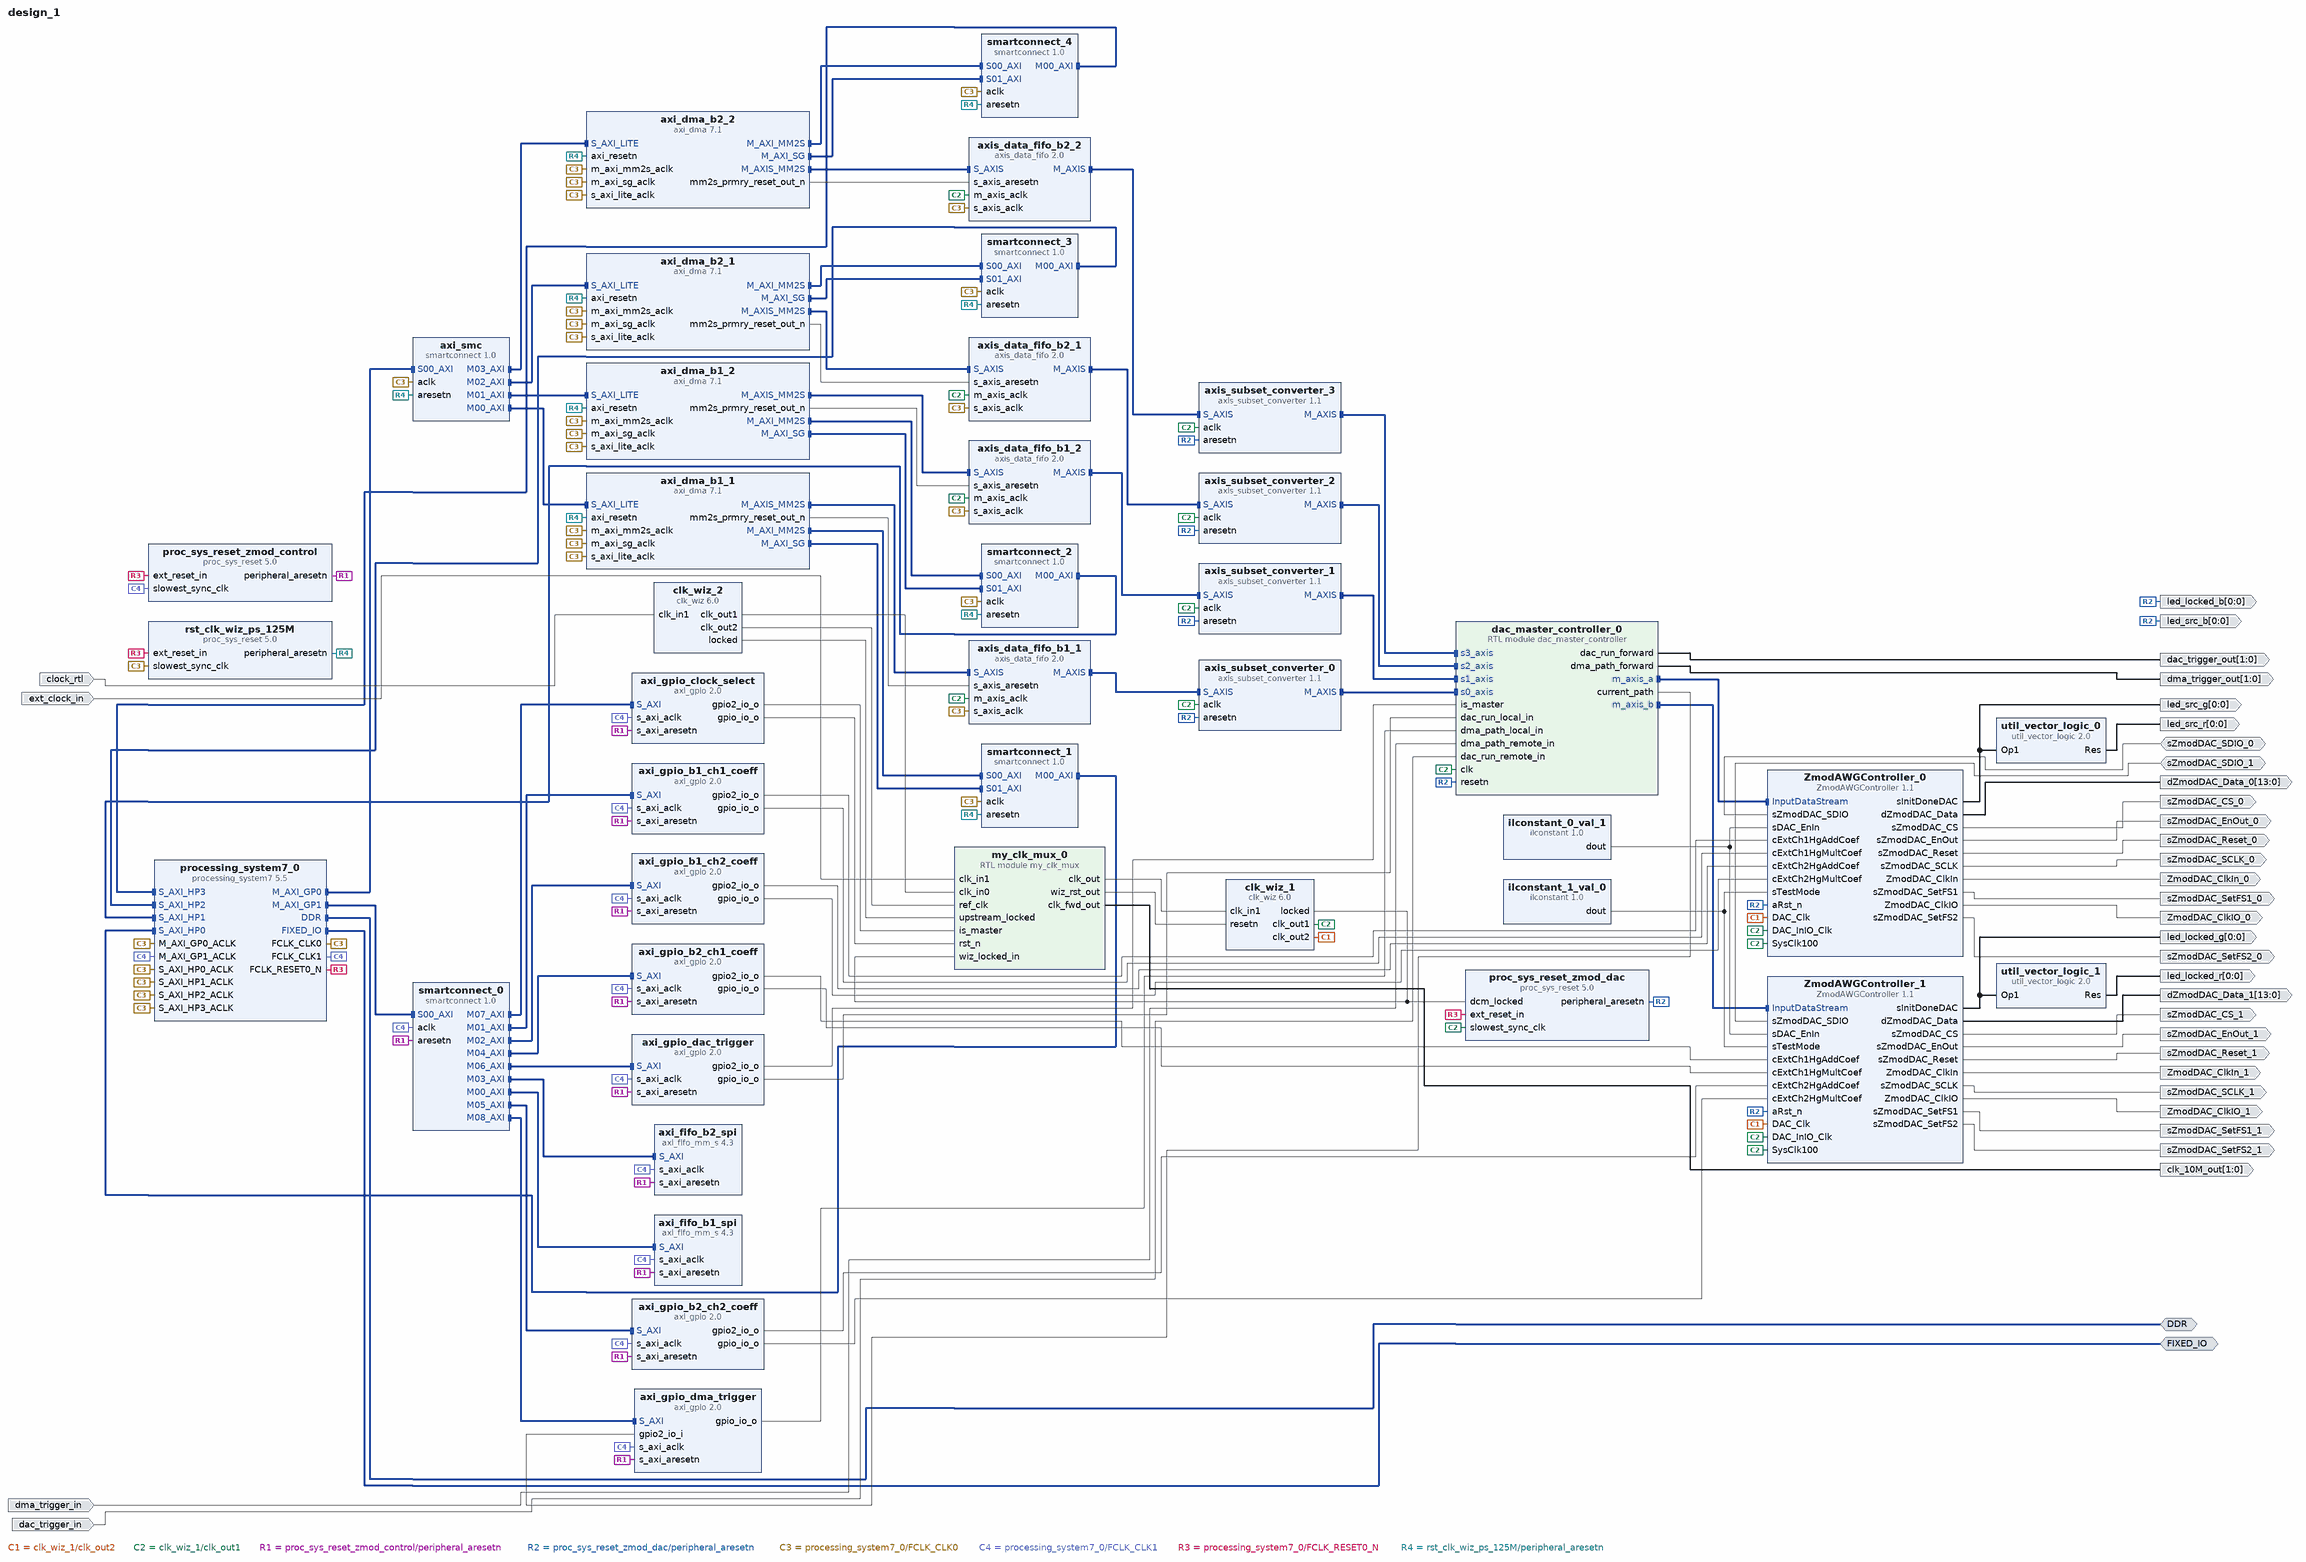
[diagram p0: block diagram of the top level]
# Vivado block design design_1, xc7z020clg484-1, Vivado 2025.1
create_bd_design design_1

create_bd_intf_port -mode Master -vlnv xilinx.com:interface:ddrx_rtl:1.0 DDR
create_bd_intf_port -mode Master -vlnv xilinx.com:display_processing_system7:fixedio_rtl:1.0 FIXED_IO
create_bd_port -dir O sZmodDAC_CS_0
create_bd_port -dir O sZmodDAC_SCLK_0
create_bd_port -dir IO sZmodDAC_SDIO_0
create_bd_port -dir O -type rst sZmodDAC_Reset_0
create_bd_port -dir O -type clk ZmodDAC_ClkIO_0
create_bd_port -dir O -type clk ZmodDAC_ClkIn_0
create_bd_port -dir O -from 13 -to 0 dZmodDAC_Data_0
create_bd_port -dir O sZmodDAC_EnOut_0
create_bd_port -dir O sZmodDAC_SetFS1_0
create_bd_port -dir O sZmodDAC_SetFS2_0
create_bd_port -dir I -type clk clock_rtl
set_property -dict {CONFIG.FREQ_HZ 125000000 CONFIG.PHASE 0.0} [get_bd_ports clock_rtl]
create_bd_port -dir O sZmodDAC_CS_1
create_bd_port -dir O sZmodDAC_SCLK_1
create_bd_port -dir IO sZmodDAC_SDIO_1
create_bd_port -dir O -type rst sZmodDAC_Reset_1
create_bd_port -dir O -type clk ZmodDAC_ClkIO_1
create_bd_port -dir O -type clk ZmodDAC_ClkIn_1
create_bd_port -dir O -from 13 -to 0 dZmodDAC_Data_1
create_bd_port -dir O sZmodDAC_SetFS1_1
create_bd_port -dir O sZmodDAC_SetFS2_1
create_bd_port -dir O sZmodDAC_EnOut_1
create_bd_port -dir I -type clk ext_clock_in
set_property -dict {CONFIG.FREQ_HZ 10000000} [get_bd_ports ext_clock_in]
create_bd_port -dir O -from 0 -to 0 led_locked_g
create_bd_port -dir O -from 0 -to 0 led_src_r
create_bd_port -dir O -from 0 -to 0 led_src_b
create_bd_port -dir O -from 0 -to 0 led_src_g
create_bd_port -dir O -from 0 -to 0 led_locked_b
create_bd_port -dir O -from 0 -to 0 led_locked_r
create_bd_port -dir I dac_trigger_in
create_bd_port -dir I dma_trigger_in
create_bd_port -dir O -from 1 -to 0 dma_trigger_out
create_bd_port -dir O -from 1 -to 0 clk_10M_out
create_bd_port -dir O -from 1 -to 0 dac_trigger_out

create_bd_cell -type ip -vlnv digilent.com:user:ZmodAWGController:1.1 ZmodAWGController_0
set_property -dict [list \
  CONFIG.kCh1ScaleStatic {"1"} \
  CONFIG.kCh2ScaleStatic {"1"} \
  CONFIG.kExtCalibEn true \
  CONFIG.kExtCmdInterfaceEn false \
  CONFIG.kExtScaleConfigEn false \
] [get_bd_cells ZmodAWGController_0]
create_bd_cell -type ip -vlnv xilinx.com:ip:processing_system7:5.5 processing_system7_0
set_property -dict [list \
  CONFIG.PCW_ENET0_ENET0_IO {MIO 16 .. 27} \
  CONFIG.PCW_ENET0_GRP_MDIO_ENABLE 1 \
  CONFIG.PCW_ENET0_GRP_MDIO_IO {MIO 52 .. 53} \
  CONFIG.PCW_ENET0_PERIPHERAL_ENABLE 1 \
  CONFIG.PCW_ENET0_RESET_ENABLE 1 \
  CONFIG.PCW_ENET0_RESET_IO {MIO 9} \
  CONFIG.PCW_ENET_RESET_ENABLE 1 \
  CONFIG.PCW_ENET_RESET_SELECT {Share reset pin} \
  CONFIG.PCW_EN_CLK1_PORT 1 \
  CONFIG.PCW_EN_RST1_PORT 1 \
  CONFIG.PCW_FPGA0_PERIPHERAL_FREQMHZ 125 \
  CONFIG.PCW_FPGA1_PERIPHERAL_FREQMHZ 100 \
  CONFIG.PCW_FPGA_FCLK1_ENABLE 1 \
  CONFIG.PCW_GPIO_MIO_GPIO_ENABLE 1 \
  CONFIG.PCW_GPIO_MIO_GPIO_IO MIO \
  CONFIG.PCW_I2C1_I2C1_IO {MIO 12 .. 13} \
  CONFIG.PCW_I2C1_PERIPHERAL_ENABLE 1 \
  CONFIG.PCW_I2C_PERIPHERAL_FREQMHZ 111.111115 \
  CONFIG.PCW_I2C_RESET_ENABLE 1 \
  CONFIG.PCW_I2C_RESET_SELECT {Share reset pin} \
  CONFIG.PCW_PRESET_BANK1_VOLTAGE {LVCMOS 1.8V} \
  CONFIG.PCW_QSPI_GRP_FBCLK_ENABLE 1 \
  CONFIG.PCW_QSPI_GRP_FBCLK_IO {MIO 8} \
  CONFIG.PCW_QSPI_GRP_SINGLE_SS_ENABLE 1 \
  CONFIG.PCW_QSPI_GRP_SINGLE_SS_IO {MIO 1 .. 6} \
  CONFIG.PCW_QSPI_PERIPHERAL_ENABLE 1 \
  CONFIG.PCW_QSPI_QSPI_IO {MIO 1 .. 6} \
  CONFIG.PCW_SD0_GRP_CD_ENABLE 1 \
  CONFIG.PCW_SD0_GRP_CD_IO {MIO 47} \
  CONFIG.PCW_SD0_GRP_WP_ENABLE 0 \
  CONFIG.PCW_SD0_PERIPHERAL_ENABLE 1 \
  CONFIG.PCW_SD0_SD0_IO {MIO 40 .. 45} \
  CONFIG.PCW_SDIO_PERIPHERAL_FREQMHZ 50 \
  CONFIG.PCW_SINGLE_QSPI_DATA_MODE x4 \
  CONFIG.PCW_S_AXI_HP0_DATA_WIDTH 32 \
  CONFIG.PCW_S_AXI_HP1_DATA_WIDTH 32 \
  CONFIG.PCW_S_AXI_HP2_DATA_WIDTH 32 \
  CONFIG.PCW_S_AXI_HP3_DATA_WIDTH 32 \
  CONFIG.PCW_UART0_PERIPHERAL_ENABLE 1 \
  CONFIG.PCW_UART0_UART0_IO {MIO 14 .. 15} \
  CONFIG.PCW_UART_PERIPHERAL_FREQMHZ 100 \
  CONFIG.PCW_UIPARAM_DDR_MEMORY_TYPE {DDR 3 (Low Voltage)} \
  CONFIG.PCW_UIPARAM_DDR_PARTNO {MT41K256M16 RE-125} \
  CONFIG.PCW_USB0_PERIPHERAL_ENABLE 1 \
  CONFIG.PCW_USB0_RESET_ENABLE 1 \
  CONFIG.PCW_USB0_RESET_IO {MIO 46} \
  CONFIG.PCW_USB0_USB0_IO {MIO 28 .. 39} \
  CONFIG.PCW_USB_RESET_ENABLE 1 \
  CONFIG.PCW_USB_RESET_SELECT {Share reset pin} \
  CONFIG.PCW_USE_AXI_NONSECURE 1 \
  CONFIG.PCW_USE_M_AXI_GP1 1 \
  CONFIG.PCW_USE_S_AXI_HP0 1 \
  CONFIG.PCW_USE_S_AXI_HP1 1 \
  CONFIG.PCW_USE_S_AXI_HP2 1 \
  CONFIG.PCW_USE_S_AXI_HP3 1 \
] [get_bd_cells processing_system7_0]
# 263 more settings of processing_system7_0 are not shown: defaults, MIO pin electricals, DDR timing, and values the tool derives
create_bd_cell -type ip -vlnv xilinx.com:ip:smartconnect:1.0 axi_smc
set_property -dict {CONFIG.NUM_CLKS 1 CONFIG.NUM_MI 4 CONFIG.NUM_SI 1} [get_bd_cells axi_smc]
create_bd_cell -type ip -vlnv xilinx.com:ip:axis_data_fifo:2.0 axis_data_fifo_b1_1
set_property -dict {CONFIG.FIFO_DEPTH 4096 CONFIG.IS_ACLK_ASYNC 1} [get_bd_cells axis_data_fifo_b1_1]
create_bd_cell -type ip -vlnv xilinx.com:ip:proc_sys_reset:5.0 rst_clk_wiz_ps_125M
create_bd_cell -type inline_hdl -vlnv xilinx.com:inline_hdl:ilconstant:1.0 ilconstant_0_val_1
create_bd_cell -type inline_hdl -vlnv xilinx.com:inline_hdl:ilconstant:1.0 ilconstant_1_val_0
set_property -dict {CONFIG.CONST_VAL 0} [get_bd_cells ilconstant_1_val_0]
create_bd_cell -type ip -vlnv xilinx.com:ip:axi_dma:7.1 axi_dma_b1_1
set_property -dict [list \
  CONFIG.c_include_s2mm 0 \
  CONFIG.c_include_sg 1 \
  CONFIG.c_mm2s_burst_size 128 \
  CONFIG.c_sg_length_width 26 \
] [get_bd_cells axi_dma_b1_1]
create_bd_cell -type ip -vlnv xilinx.com:ip:axi_gpio:2.0 axi_gpio_dac_trigger
set_property -dict [list \
  CONFIG.C_ALL_OUTPUTS 1 \
  CONFIG.C_DOUT_DEFAULT_2 0x00000001 \
  CONFIG.C_GPIO2_WIDTH 1 \
  CONFIG.C_GPIO_WIDTH 1 \
  CONFIG.C_IS_DUAL 1 \
] [get_bd_cells axi_gpio_dac_trigger]
create_bd_cell -type ip -vlnv xilinx.com:ip:proc_sys_reset:5.0 proc_sys_reset_zmod_dac
create_bd_cell -type ip -vlnv xilinx.com:ip:axi_fifo_mm_s:4.3 axi_fifo_b1_spi
set_property -dict {CONFIG.C_USE_TX_CTRL 0} [get_bd_cells axi_fifo_b1_spi]
create_bd_cell -type ip -vlnv xilinx.com:ip:axi_gpio:2.0 axi_gpio_b1_ch1_coeff
set_property -dict [list \
  CONFIG.C_ALL_OUTPUTS 1 \
  CONFIG.C_ALL_OUTPUTS_2 1 \
  CONFIG.C_GPIO2_WIDTH 18 \
  CONFIG.C_GPIO_WIDTH 18 \
  CONFIG.C_IS_DUAL 1 \
] [get_bd_cells axi_gpio_b1_ch1_coeff]
create_bd_cell -type ip -vlnv xilinx.com:ip:axi_gpio:2.0 axi_gpio_b1_ch2_coeff
set_property -dict [list \
  CONFIG.C_ALL_OUTPUTS 1 \
  CONFIG.C_ALL_OUTPUTS_2 1 \
  CONFIG.C_GPIO2_WIDTH 18 \
  CONFIG.C_GPIO_WIDTH 18 \
  CONFIG.C_IS_DUAL 1 \
] [get_bd_cells axi_gpio_b1_ch2_coeff]
create_bd_cell -type ip -vlnv digilent.com:user:ZmodAWGController:1.1 ZmodAWGController_1
set_property -dict [list \
  CONFIG.kCh1ScaleStatic {"1"} \
  CONFIG.kCh2ScaleStatic {"1"} \
  CONFIG.kExtCalibEn true \
  CONFIG.kExtCmdInterfaceEn false \
] [get_bd_cells ZmodAWGController_1]
create_bd_cell -type ip -vlnv xilinx.com:ip:axi_dma:7.1 axi_dma_b2_1
set_property -dict [list \
  CONFIG.c_include_s2mm 0 \
  CONFIG.c_include_sg 1 \
  CONFIG.c_mm2s_burst_size 128 \
  CONFIG.c_sg_length_width 26 \
] [get_bd_cells axi_dma_b2_1]
create_bd_cell -type ip -vlnv xilinx.com:ip:axis_data_fifo:2.0 axis_data_fifo_b2_1
set_property -dict {CONFIG.FIFO_DEPTH 4096 CONFIG.IS_ACLK_ASYNC 1} [get_bd_cells axis_data_fifo_b2_1]
create_bd_cell -type ip -vlnv xilinx.com:ip:axi_gpio:2.0 axi_gpio_b2_ch1_coeff
set_property -dict [list \
  CONFIG.C_ALL_OUTPUTS 1 \
  CONFIG.C_ALL_OUTPUTS_2 1 \
  CONFIG.C_GPIO2_WIDTH 18 \
  CONFIG.C_GPIO_WIDTH 18 \
  CONFIG.C_IS_DUAL 1 \
] [get_bd_cells axi_gpio_b2_ch1_coeff]
create_bd_cell -type ip -vlnv xilinx.com:ip:axi_gpio:2.0 axi_gpio_b2_ch2_coeff
set_property -dict [list \
  CONFIG.C_ALL_OUTPUTS 1 \
  CONFIG.C_ALL_OUTPUTS_2 1 \
  CONFIG.C_GPIO2_WIDTH 18 \
  CONFIG.C_GPIO_WIDTH 18 \
  CONFIG.C_IS_DUAL 1 \
] [get_bd_cells axi_gpio_b2_ch2_coeff]
create_bd_cell -type ip -vlnv xilinx.com:ip:axi_fifo_mm_s:4.3 axi_fifo_b2_spi
set_property -dict {CONFIG.C_USE_TX_CTRL 0} [get_bd_cells axi_fifo_b2_spi]
create_bd_cell -type ip -vlnv xilinx.com:ip:smartconnect:1.0 smartconnect_0
set_property -dict {CONFIG.NUM_CLKS 1 CONFIG.NUM_MI 9 CONFIG.NUM_SI 1} [get_bd_cells smartconnect_0]
create_bd_cell -type ip -vlnv xilinx.com:ip:proc_sys_reset:5.0 proc_sys_reset_zmod_control
create_bd_cell -type ip -vlnv xilinx.com:ip:clk_wiz:6.0 clk_wiz_1
set_property -dict [list \
  CONFIG.CLKIN1_JITTER_PS 1000.0 \
  CONFIG.CLKIN2_JITTER_PS 1000.0 \
  CONFIG.CLKOUT1_JITTER 674.201 \
  CONFIG.CLKOUT1_PHASE_ERROR 874.060 \
  CONFIG.CLKOUT1_REQUESTED_PHASE 0 \
  CONFIG.CLKOUT2_JITTER 674.201 \
  CONFIG.CLKOUT2_PHASE_ERROR 874.060 \
  CONFIG.CLKOUT2_REQUESTED_PHASE 90 \
  CONFIG.CLKOUT2_USED true \
  CONFIG.CLK_IN1_BOARD_INTERFACE Custom \
  CONFIG.CLK_IN2_BOARD_INTERFACE Custom \
  CONFIG.JITTER_SEL Min_O_Jitter \
  CONFIG.MMCM_BANDWIDTH HIGH \
  CONFIG.MMCM_CLKFBOUT_MULT_F 60.000 \
  CONFIG.MMCM_CLKIN1_PERIOD 100.0 \
  CONFIG.MMCM_CLKIN2_PERIOD 100.0 \
  CONFIG.MMCM_CLKOUT0_DIVIDE_F 6.000 \
  CONFIG.MMCM_CLKOUT0_PHASE 0.000 \
  CONFIG.MMCM_CLKOUT1_DIVIDE 6 \
  CONFIG.MMCM_CLKOUT1_PHASE 90.000 \
  CONFIG.NUM_OUT_CLKS 2 \
  CONFIG.PRIM_IN_FREQ 10 \
  CONFIG.PRIM_SOURCE Global_buffer \
  CONFIG.RESET_PORT resetn \
  CONFIG.RESET_TYPE ACTIVE_LOW \
  CONFIG.SECONDARY_IN_FREQ 10 \
  CONFIG.SECONDARY_SOURCE Global_buffer \
  CONFIG.USE_INCLK_SWITCHOVER false \
  CONFIG.USE_RESET true \
] [get_bd_cells clk_wiz_1]
create_bd_cell -type ip -vlnv xilinx.com:ip:axi_gpio:2.0 axi_gpio_clock_select
set_property -dict [list \
  CONFIG.C_ALL_INPUTS 0 \
  CONFIG.C_ALL_OUTPUTS 1 \
  CONFIG.C_DOUT_DEFAULT 0x00000000 \
  CONFIG.C_GPIO_WIDTH 1 \
  CONFIG.C_IS_DUAL 1 \
] [get_bd_cells axi_gpio_clock_select]
create_bd_cell -type module -reference my_clk_mux my_clk_mux_0
create_bd_cell -type ip -vlnv xilinx.com:ip:clk_wiz:6.0 clk_wiz_2
set_property -dict [list \
  CONFIG.CLKIN1_JITTER_PS 80.0 \
  CONFIG.CLKOUT1_JITTER 186.538 \
  CONFIG.CLKOUT1_PHASE_ERROR 89.430 \
  CONFIG.CLKOUT1_REQUESTED_OUT_FREQ 10 \
  CONFIG.CLKOUT2_JITTER 112.261 \
  CONFIG.CLKOUT2_PHASE_ERROR 89.430 \
  CONFIG.CLKOUT2_REQUESTED_OUT_FREQ 125 \
  CONFIG.CLKOUT2_USED true \
  CONFIG.CLK_IN1_BOARD_INTERFACE sys_clock \
  CONFIG.JITTER_SEL Min_O_Jitter \
  CONFIG.MMCM_BANDWIDTH HIGH \
  CONFIG.MMCM_CLKFBOUT_MULT_F 9.000 \
  CONFIG.MMCM_CLKIN1_PERIOD 8.000 \
  CONFIG.MMCM_CLKOUT0_DIVIDE_F 112.500 \
  CONFIG.MMCM_CLKOUT1_DIVIDE 9 \
  CONFIG.NUM_OUT_CLKS 2 \
  CONFIG.USE_RESET false \
] [get_bd_cells clk_wiz_2]
create_bd_cell -type ip -vlnv xilinx.com:ip:util_vector_logic:2.0 util_vector_logic_0
set_property -dict {CONFIG.C_OPERATION not CONFIG.C_SIZE 1} [get_bd_cells util_vector_logic_0]
create_bd_cell -type ip -vlnv xilinx.com:ip:util_vector_logic:2.0 util_vector_logic_1
set_property -dict {CONFIG.C_OPERATION not CONFIG.C_SIZE 1} [get_bd_cells util_vector_logic_1]
create_bd_cell -type module -reference dac_master_controller dac_master_controller_0
create_bd_cell -type ip -vlnv xilinx.com:ip:axi_dma:7.1 axi_dma_b1_2
set_property -dict [list \
  CONFIG.c_include_s2mm 0 \
  CONFIG.c_mm2s_burst_size 128 \
  CONFIG.c_sg_include_stscntrl_strm 0 \
  CONFIG.c_sg_length_width 26 \
] [get_bd_cells axi_dma_b1_2]
create_bd_cell -type ip -vlnv xilinx.com:ip:axi_dma:7.1 axi_dma_b2_2
set_property -dict [list \
  CONFIG.c_include_s2mm 0 \
  CONFIG.c_mm2s_burst_size 128 \
  CONFIG.c_sg_include_stscntrl_strm 0 \
  CONFIG.c_sg_length_width 26 \
] [get_bd_cells axi_dma_b2_2]
create_bd_cell -type ip -vlnv xilinx.com:ip:axis_data_fifo:2.0 axis_data_fifo_b1_2
set_property -dict {CONFIG.FIFO_DEPTH 4096 CONFIG.IS_ACLK_ASYNC 1} [get_bd_cells axis_data_fifo_b1_2]
create_bd_cell -type ip -vlnv xilinx.com:ip:axis_data_fifo:2.0 axis_data_fifo_b2_2
set_property -dict {CONFIG.FIFO_DEPTH 4096 CONFIG.IS_ACLK_ASYNC 1} [get_bd_cells axis_data_fifo_b2_2]
create_bd_cell -type ip -vlnv xilinx.com:ip:axi_gpio:2.0 axi_gpio_dma_trigger
set_property -dict [list \
  CONFIG.C_ALL_INPUTS_2 1 \
  CONFIG.C_ALL_OUTPUTS 1 \
  CONFIG.C_DOUT_DEFAULT 0x00000000 \
  CONFIG.C_GPIO2_WIDTH 1 \
  CONFIG.C_GPIO_WIDTH 1 \
  CONFIG.C_IS_DUAL 1 \
] [get_bd_cells axi_gpio_dma_trigger]
create_bd_cell -type ip -vlnv xilinx.com:ip:smartconnect:1.0 smartconnect_1
create_bd_cell -type ip -vlnv xilinx.com:ip:smartconnect:1.0 smartconnect_2
create_bd_cell -type ip -vlnv xilinx.com:ip:smartconnect:1.0 smartconnect_3
create_bd_cell -type ip -vlnv xilinx.com:ip:smartconnect:1.0 smartconnect_4
create_bd_cell -type ip -vlnv xilinx.com:ip:axis_subset_converter:1.1 axis_subset_converter_0
set_property -dict [list \
  CONFIG.M_HAS_TREADY 1 \
  CONFIG.M_HAS_TSTRB 0 \
  CONFIG.M_TDATA_NUM_BYTES 4 \
  CONFIG.M_TDEST_WIDTH 0 \
  CONFIG.M_TID_WIDTH 0 \
  CONFIG.M_TUSER_WIDTH 0 \
  CONFIG.S_HAS_TKEEP 1 \
  CONFIG.S_HAS_TLAST 1 \
  CONFIG.S_HAS_TREADY 1 \
  CONFIG.S_HAS_TSTRB 0 \
  CONFIG.S_TDATA_NUM_BYTES 4 \
  CONFIG.S_TDEST_WIDTH 0 \
  CONFIG.S_TID_WIDTH 0 \
  CONFIG.S_TUSER_WIDTH 0 \
] [get_bd_cells axis_subset_converter_0]
create_bd_cell -type ip -vlnv xilinx.com:ip:axis_subset_converter:1.1 axis_subset_converter_1
set_property -dict [list \
  CONFIG.M_HAS_TLAST 1 \
  CONFIG.M_HAS_TREADY 1 \
  CONFIG.M_TDATA_NUM_BYTES 4 \
  CONFIG.M_TDEST_WIDTH 0 \
  CONFIG.M_TID_WIDTH 0 \
  CONFIG.M_TUSER_WIDTH 0 \
  CONFIG.S_HAS_TKEEP 1 \
  CONFIG.S_HAS_TLAST 1 \
  CONFIG.S_HAS_TREADY 1 \
  CONFIG.S_HAS_TSTRB 0 \
  CONFIG.S_TDATA_NUM_BYTES 4 \
  CONFIG.S_TDEST_WIDTH 0 \
  CONFIG.S_TID_WIDTH 0 \
  CONFIG.S_TUSER_WIDTH 0 \
] [get_bd_cells axis_subset_converter_1]
create_bd_cell -type ip -vlnv xilinx.com:ip:axis_subset_converter:1.1 axis_subset_converter_2
set_property -dict [list \
  CONFIG.M_HAS_TLAST 1 \
  CONFIG.M_HAS_TREADY 1 \
  CONFIG.M_TDATA_NUM_BYTES 4 \
  CONFIG.M_TDEST_WIDTH 0 \
  CONFIG.M_TID_WIDTH 0 \
  CONFIG.M_TUSER_WIDTH 0 \
  CONFIG.S_HAS_TKEEP 1 \
  CONFIG.S_HAS_TLAST 1 \
  CONFIG.S_HAS_TREADY 1 \
  CONFIG.S_HAS_TSTRB 0 \
  CONFIG.S_TDATA_NUM_BYTES 4 \
  CONFIG.S_TDEST_WIDTH 0 \
  CONFIG.S_TID_WIDTH 0 \
  CONFIG.S_TUSER_WIDTH 0 \
] [get_bd_cells axis_subset_converter_2]
create_bd_cell -type ip -vlnv xilinx.com:ip:axis_subset_converter:1.1 axis_subset_converter_3
set_property -dict [list \
  CONFIG.M_HAS_TLAST 1 \
  CONFIG.M_HAS_TREADY 1 \
  CONFIG.M_TDATA_NUM_BYTES 4 \
  CONFIG.M_TDEST_WIDTH 0 \
  CONFIG.M_TID_WIDTH 0 \
  CONFIG.M_TUSER_WIDTH 0 \
  CONFIG.S_HAS_TKEEP 1 \
  CONFIG.S_HAS_TLAST 1 \
  CONFIG.S_HAS_TREADY 1 \
  CONFIG.S_HAS_TSTRB 0 \
  CONFIG.S_TDATA_NUM_BYTES 4 \
  CONFIG.S_TDEST_WIDTH 0 \
  CONFIG.S_TID_WIDTH 0 \
  CONFIG.S_TUSER_WIDTH 0 \
] [get_bd_cells axis_subset_converter_3]

# ---- connections ----

connect_bd_intf_net -intf_net axi_dma_0_M_AXIS_MM2S [get_bd_intf_pins axis_data_fifo_b1_1/S_AXIS] [get_bd_intf_pins axi_dma_b1_1/M_AXIS_MM2S]
connect_bd_intf_net -intf_net axi_dma_1_M_AXIS_MM2S [get_bd_intf_pins axi_dma_b2_1/M_AXIS_MM2S] [get_bd_intf_pins axis_data_fifo_b2_1/S_AXIS]
connect_bd_intf_net [get_bd_intf_pins axi_dma_b1_1/M_AXI_MM2S] [get_bd_intf_pins smartconnect_1/S00_AXI]
connect_bd_intf_net [get_bd_intf_pins axi_dma_b1_1/M_AXI_SG] [get_bd_intf_pins smartconnect_1/S01_AXI]
connect_bd_intf_net [get_bd_intf_pins axi_dma_b1_2/M_AXIS_MM2S] [get_bd_intf_pins axis_data_fifo_b1_2/S_AXIS]
connect_bd_intf_net [get_bd_intf_pins axi_dma_b1_2/M_AXI_MM2S] [get_bd_intf_pins smartconnect_2/S00_AXI]
connect_bd_intf_net [get_bd_intf_pins axi_dma_b1_2/M_AXI_SG] [get_bd_intf_pins smartconnect_2/S01_AXI]
connect_bd_intf_net [get_bd_intf_pins axi_dma_b2_1/M_AXI_MM2S] [get_bd_intf_pins smartconnect_3/S00_AXI]
connect_bd_intf_net [get_bd_intf_pins axi_dma_b2_1/M_AXI_SG] [get_bd_intf_pins smartconnect_3/S01_AXI]
connect_bd_intf_net [get_bd_intf_pins axi_dma_b2_2/M_AXIS_MM2S] [get_bd_intf_pins axis_data_fifo_b2_2/S_AXIS]
connect_bd_intf_net [get_bd_intf_pins axi_dma_b2_2/M_AXI_MM2S] [get_bd_intf_pins smartconnect_4/S00_AXI]
connect_bd_intf_net [get_bd_intf_pins axi_dma_b2_2/M_AXI_SG] [get_bd_intf_pins smartconnect_4/S01_AXI]
connect_bd_intf_net [get_bd_intf_pins axi_dma_b1_1/S_AXI_LITE] [get_bd_intf_pins axi_smc/M00_AXI]
connect_bd_intf_net [get_bd_intf_pins axi_dma_b1_2/S_AXI_LITE] [get_bd_intf_pins axi_smc/M01_AXI]
connect_bd_intf_net [get_bd_intf_pins axi_smc/M02_AXI] [get_bd_intf_pins axi_dma_b2_1/S_AXI_LITE]
connect_bd_intf_net [get_bd_intf_pins axi_dma_b2_2/S_AXI_LITE] [get_bd_intf_pins axi_smc/M03_AXI]
connect_bd_intf_net [get_bd_intf_pins axis_data_fifo_b1_1/M_AXIS] [get_bd_intf_pins axis_subset_converter_0/S_AXIS]
connect_bd_intf_net [get_bd_intf_pins axis_subset_converter_1/S_AXIS] [get_bd_intf_pins axis_data_fifo_b1_2/M_AXIS]
connect_bd_intf_net [get_bd_intf_pins axis_data_fifo_b2_1/M_AXIS] [get_bd_intf_pins axis_subset_converter_2/S_AXIS]
connect_bd_intf_net [get_bd_intf_pins axis_data_fifo_b2_2/M_AXIS] [get_bd_intf_pins axis_subset_converter_3/S_AXIS]
connect_bd_intf_net [get_bd_intf_pins axis_subset_converter_0/M_AXIS] [get_bd_intf_pins dac_master_controller_0/s0_axis]
connect_bd_intf_net [get_bd_intf_pins axis_subset_converter_1/M_AXIS] [get_bd_intf_pins dac_master_controller_0/s1_axis]
connect_bd_intf_net [get_bd_intf_pins axis_subset_converter_2/M_AXIS] [get_bd_intf_pins dac_master_controller_0/s2_axis]
connect_bd_intf_net [get_bd_intf_pins axis_subset_converter_3/M_AXIS] [get_bd_intf_pins dac_master_controller_0/s3_axis]
connect_bd_intf_net [get_bd_intf_pins dac_master_controller_0/m_axis_a] [get_bd_intf_pins ZmodAWGController_0/InputDataStream]
connect_bd_intf_net [get_bd_intf_pins dac_master_controller_0/m_axis_b] [get_bd_intf_pins ZmodAWGController_1/InputDataStream]
connect_bd_intf_net [get_bd_intf_ports DDR] [get_bd_intf_pins processing_system7_0/DDR]
connect_bd_intf_net [get_bd_intf_ports FIXED_IO] [get_bd_intf_pins processing_system7_0/FIXED_IO]
connect_bd_intf_net [get_bd_intf_pins processing_system7_0/M_AXI_GP0] [get_bd_intf_pins axi_smc/S00_AXI]
connect_bd_intf_net [get_bd_intf_pins processing_system7_0/M_AXI_GP1] [get_bd_intf_pins smartconnect_0/S00_AXI]
connect_bd_intf_net [get_bd_intf_pins axi_fifo_b1_spi/S_AXI] [get_bd_intf_pins smartconnect_0/M00_AXI]
connect_bd_intf_net [get_bd_intf_pins axi_gpio_b1_ch1_coeff/S_AXI] [get_bd_intf_pins smartconnect_0/M01_AXI]
connect_bd_intf_net [get_bd_intf_pins axi_gpio_b1_ch2_coeff/S_AXI] [get_bd_intf_pins smartconnect_0/M02_AXI]
connect_bd_intf_net [get_bd_intf_pins axi_fifo_b2_spi/S_AXI] [get_bd_intf_pins smartconnect_0/M03_AXI]
connect_bd_intf_net [get_bd_intf_pins axi_gpio_b2_ch1_coeff/S_AXI] [get_bd_intf_pins smartconnect_0/M04_AXI]
connect_bd_intf_net [get_bd_intf_pins axi_gpio_b2_ch2_coeff/S_AXI] [get_bd_intf_pins smartconnect_0/M05_AXI]
connect_bd_intf_net [get_bd_intf_pins axi_gpio_dac_trigger/S_AXI] [get_bd_intf_pins smartconnect_0/M06_AXI]
connect_bd_intf_net [get_bd_intf_pins smartconnect_0/M07_AXI] [get_bd_intf_pins axi_gpio_clock_select/S_AXI]
connect_bd_intf_net [get_bd_intf_pins axi_gpio_dma_trigger/S_AXI] [get_bd_intf_pins smartconnect_0/M08_AXI]
connect_bd_intf_net [get_bd_intf_pins smartconnect_1/M00_AXI] [get_bd_intf_pins processing_system7_0/S_AXI_HP0]
connect_bd_intf_net [get_bd_intf_pins smartconnect_2/M00_AXI] [get_bd_intf_pins processing_system7_0/S_AXI_HP1]
connect_bd_intf_net [get_bd_intf_pins smartconnect_3/M00_AXI] [get_bd_intf_pins processing_system7_0/S_AXI_HP2]
connect_bd_intf_net [get_bd_intf_pins smartconnect_4/M00_AXI] [get_bd_intf_pins processing_system7_0/S_AXI_HP3]
connect_bd_net [get_bd_ports sZmodDAC_SDIO_0] [get_bd_pins ZmodAWGController_0/sZmodDAC_SDIO]
connect_bd_net [get_bd_ports sZmodDAC_SDIO_1] [get_bd_pins ZmodAWGController_1/sZmodDAC_SDIO]
connect_bd_net [get_bd_pins clk_wiz_1/clk_out2] [get_bd_pins ZmodAWGController_0/DAC_Clk] [get_bd_pins ZmodAWGController_1/DAC_Clk]
connect_bd_net [get_bd_pins ZmodAWGController_0/ZmodDAC_ClkIO] [get_bd_ports ZmodDAC_ClkIO_0]
connect_bd_net [get_bd_pins ZmodAWGController_0/ZmodDAC_ClkIn] [get_bd_ports ZmodDAC_ClkIn_0]
connect_bd_net [get_bd_pins ZmodAWGController_0/dZmodDAC_Data] [get_bd_ports dZmodDAC_Data_0]
connect_bd_net [get_bd_pins ZmodAWGController_0/sInitDoneDAC] [get_bd_pins util_vector_logic_0/Op1] [get_bd_ports led_src_g]
connect_bd_net [get_bd_pins ZmodAWGController_0/sZmodDAC_CS] [get_bd_ports sZmodDAC_CS_0]
connect_bd_net [get_bd_pins ZmodAWGController_0/sZmodDAC_EnOut] [get_bd_ports sZmodDAC_EnOut_0]
connect_bd_net [get_bd_pins ZmodAWGController_0/sZmodDAC_Reset] [get_bd_ports sZmodDAC_Reset_0]
connect_bd_net [get_bd_pins ZmodAWGController_0/sZmodDAC_SCLK] [get_bd_ports sZmodDAC_SCLK_0]
connect_bd_net [get_bd_pins ZmodAWGController_0/sZmodDAC_SetFS1] [get_bd_ports sZmodDAC_SetFS1_0]
connect_bd_net [get_bd_pins ZmodAWGController_0/sZmodDAC_SetFS2] [get_bd_ports sZmodDAC_SetFS2_0]
connect_bd_net [get_bd_pins ZmodAWGController_1/ZmodDAC_ClkIO] [get_bd_ports ZmodDAC_ClkIO_1]
connect_bd_net [get_bd_pins ZmodAWGController_1/ZmodDAC_ClkIn] [get_bd_ports ZmodDAC_ClkIn_1]
connect_bd_net [get_bd_pins ZmodAWGController_1/dZmodDAC_Data] [get_bd_ports dZmodDAC_Data_1]
connect_bd_net [get_bd_pins ZmodAWGController_1/sInitDoneDAC] [get_bd_pins util_vector_logic_1/Op1] [get_bd_ports led_locked_g]
connect_bd_net [get_bd_pins ZmodAWGController_1/sZmodDAC_CS] [get_bd_ports sZmodDAC_CS_1]
connect_bd_net [get_bd_pins ZmodAWGController_1/sZmodDAC_EnOut] [get_bd_ports sZmodDAC_EnOut_1]
connect_bd_net [get_bd_pins ZmodAWGController_1/sZmodDAC_Reset] [get_bd_ports sZmodDAC_Reset_1]
connect_bd_net [get_bd_pins ZmodAWGController_1/sZmodDAC_SCLK] [get_bd_ports sZmodDAC_SCLK_1]
connect_bd_net [get_bd_pins ZmodAWGController_1/sZmodDAC_SetFS1] [get_bd_ports sZmodDAC_SetFS1_1]
connect_bd_net [get_bd_pins ZmodAWGController_1/sZmodDAC_SetFS2] [get_bd_ports sZmodDAC_SetFS2_1]
connect_bd_net [get_bd_pins axi_dma_b1_1/mm2s_prmry_reset_out_n] [get_bd_pins axis_data_fifo_b1_1/s_axis_aresetn]
connect_bd_net [get_bd_pins axi_dma_b1_2/mm2s_prmry_reset_out_n] [get_bd_pins axis_data_fifo_b1_2/s_axis_aresetn]
connect_bd_net [get_bd_pins axi_dma_b2_1/mm2s_prmry_reset_out_n] [get_bd_pins axis_data_fifo_b2_1/s_axis_aresetn]
connect_bd_net [get_bd_pins axi_dma_b2_2/mm2s_prmry_reset_out_n] [get_bd_pins axis_data_fifo_b2_2/s_axis_aresetn]
connect_bd_net -net axi_gpio_0_gpio2_io_o [get_bd_pins axi_gpio_b1_ch1_coeff/gpio2_io_o] [get_bd_pins ZmodAWGController_0/cExtCh1HgAddCoef]
connect_bd_net -net axi_gpio_0_gpio_io_o [get_bd_pins axi_gpio_b1_ch1_coeff/gpio_io_o] [get_bd_pins ZmodAWGController_0/cExtCh1HgMultCoef]
connect_bd_net -net axi_gpio_0_gpio_io_o1 [get_bd_pins axi_gpio_dma_trigger/gpio_io_o] [get_bd_pins dac_master_controller_0/dma_path_local_in]
connect_bd_net -net axi_gpio_1_gpio2_io_o [get_bd_pins axi_gpio_b1_ch2_coeff/gpio2_io_o] [get_bd_pins ZmodAWGController_0/cExtCh2HgAddCoef]
connect_bd_net -net axi_gpio_1_gpio_io_o [get_bd_pins axi_gpio_b1_ch2_coeff/gpio_io_o] [get_bd_pins ZmodAWGController_0/cExtCh2HgMultCoef]
connect_bd_net [get_bd_pins axi_gpio_b2_ch1_coeff/gpio2_io_o] [get_bd_pins ZmodAWGController_1/cExtCh1HgAddCoef]
connect_bd_net [get_bd_pins axi_gpio_b2_ch1_coeff/gpio_io_o] [get_bd_pins ZmodAWGController_1/cExtCh1HgMultCoef]
connect_bd_net [get_bd_pins axi_gpio_b2_ch2_coeff/gpio2_io_o] [get_bd_pins ZmodAWGController_1/cExtCh2HgAddCoef]
connect_bd_net [get_bd_pins axi_gpio_b2_ch2_coeff/gpio_io_o] [get_bd_pins ZmodAWGController_1/cExtCh2HgMultCoef]
connect_bd_net [get_bd_pins axi_gpio_clock_select/gpio2_io_o] [get_bd_pins my_clk_mux_0/is_master]
connect_bd_net [get_bd_pins axi_gpio_clock_select/gpio_io_o] [get_bd_pins my_clk_mux_0/rst_n]
connect_bd_net [get_bd_pins axi_gpio_dac_trigger/gpio2_io_o] [get_bd_pins dac_master_controller_0/is_master]
connect_bd_net -net clk_in1_0_1 [get_bd_ports ext_clock_in] [get_bd_pins my_clk_mux_0/clk_in1]
connect_bd_net [get_bd_pins clk_wiz_1/clk_out1] \
  [get_bd_pins proc_sys_reset_zmod_dac/slowest_sync_clk] [get_bd_pins ZmodAWGController_1/DAC_InIO_Clk] \
  [get_bd_pins ZmodAWGController_0/DAC_InIO_Clk] [get_bd_pins axis_data_fifo_b2_1/m_axis_aclk] \
  [get_bd_pins axis_data_fifo_b1_1/m_axis_aclk] [get_bd_pins axis_data_fifo_b2_2/m_axis_aclk] \
  [get_bd_pins axis_data_fifo_b1_2/m_axis_aclk] [get_bd_pins axis_subset_converter_3/aclk] \
  [get_bd_pins axis_subset_converter_2/aclk] [get_bd_pins axis_subset_converter_1/aclk] \
  [get_bd_pins axis_subset_converter_0/aclk] [get_bd_pins dac_master_controller_0/clk] \
  [get_bd_pins ZmodAWGController_1/SysClk100] [get_bd_pins ZmodAWGController_0/SysClk100]
connect_bd_net [get_bd_pins clk_wiz_1/locked] [get_bd_pins proc_sys_reset_zmod_dac/dcm_locked] [get_bd_pins my_clk_mux_0/wiz_locked_in]
connect_bd_net [get_bd_pins clk_wiz_2/clk_out1] [get_bd_pins my_clk_mux_0/clk_in0]
connect_bd_net [get_bd_pins clk_wiz_2/clk_out2] [get_bd_pins my_clk_mux_0/ref_clk]
connect_bd_net [get_bd_pins clk_wiz_2/locked] [get_bd_pins my_clk_mux_0/upstream_locked]
connect_bd_net [get_bd_ports clock_rtl] [get_bd_pins clk_wiz_2/clk_in1]
connect_bd_net [get_bd_pins dac_master_controller_0/current_path] [get_bd_pins axi_gpio_dma_trigger/gpio2_io_i]
connect_bd_net [get_bd_pins dac_master_controller_0/dac_run_forward] [get_bd_ports dac_trigger_out]
connect_bd_net -net dac_master_controller_0_trigger_out [get_bd_pins dac_master_controller_0/dma_path_forward] [get_bd_ports dma_trigger_out]
connect_bd_net -net hw_trigger_0_1 [get_bd_ports dma_trigger_in] [get_bd_pins dac_master_controller_0/dma_path_remote_in]
connect_bd_net [get_bd_pins ilconstant_0_val_1/dout] [get_bd_pins ZmodAWGController_0/sDAC_EnIn] [get_bd_pins ZmodAWGController_1/sDAC_EnIn]
connect_bd_net [get_bd_pins ilconstant_1_val_0/dout] [get_bd_pins ZmodAWGController_0/sTestMode] [get_bd_pins ZmodAWGController_1/sTestMode]
connect_bd_net [get_bd_pins my_clk_mux_0/clk_fwd_out] [get_bd_ports clk_10M_out]
connect_bd_net [get_bd_pins my_clk_mux_0/clk_out] [get_bd_pins clk_wiz_1/clk_in1]
connect_bd_net [get_bd_pins my_clk_mux_0/wiz_rst_out] [get_bd_pins clk_wiz_1/resetn]
connect_bd_net [get_bd_pins proc_sys_reset_zmod_control/peripheral_aresetn] \
  [get_bd_pins axi_fifo_b2_spi/s_axi_aresetn] [get_bd_pins axi_gpio_b2_ch1_coeff/s_axi_aresetn] \
  [get_bd_pins axi_gpio_b2_ch2_coeff/s_axi_aresetn] [get_bd_pins smartconnect_0/aresetn] \
  [get_bd_pins axi_gpio_b1_ch2_coeff/s_axi_aresetn] [get_bd_pins axi_gpio_b1_ch1_coeff/s_axi_aresetn] \
  [get_bd_pins axi_fifo_b1_spi/s_axi_aresetn] [get_bd_pins axi_gpio_dac_trigger/s_axi_aresetn] \
  [get_bd_pins axi_gpio_clock_select/s_axi_aresetn] [get_bd_pins axi_gpio_dma_trigger/s_axi_aresetn]
connect_bd_net [get_bd_pins proc_sys_reset_zmod_dac/peripheral_aresetn] \
  [get_bd_pins axis_subset_converter_3/aresetn] [get_bd_pins axis_subset_converter_0/aresetn] \
  [get_bd_pins axis_subset_converter_1/aresetn] [get_bd_pins axis_subset_converter_2/aresetn] \
  [get_bd_pins dac_master_controller_0/resetn] [get_bd_pins ZmodAWGController_0/aRst_n] \
  [get_bd_pins ZmodAWGController_1/aRst_n] [get_bd_ports led_src_b] [get_bd_ports led_locked_b]
connect_bd_net [get_bd_pins processing_system7_0/FCLK_CLK0] \
  [get_bd_pins processing_system7_0/S_AXI_HP0_ACLK] [get_bd_pins processing_system7_0/S_AXI_HP1_ACLK] \
  [get_bd_pins axi_dma_b2_1/m_axi_sg_aclk] [get_bd_pins axi_dma_b2_1/m_axi_mm2s_aclk] \
  [get_bd_pins axi_dma_b1_1/m_axi_sg_aclk] [get_bd_pins axi_smc/aclk] [get_bd_pins processing_system7_0/M_AXI_GP0_ACLK] \
  [get_bd_pins axi_dma_b2_1/s_axi_lite_aclk] [get_bd_pins axi_dma_b1_1/s_axi_lite_aclk] \
  [get_bd_pins rst_clk_wiz_ps_125M/slowest_sync_clk] [get_bd_pins axis_data_fifo_b2_1/s_axis_aclk] \
  [get_bd_pins axis_data_fifo_b1_1/s_axis_aclk] [get_bd_pins processing_system7_0/S_AXI_HP2_ACLK] \
  [get_bd_pins processing_system7_0/S_AXI_HP3_ACLK] [get_bd_pins axi_dma_b1_2/s_axi_lite_aclk] \
  [get_bd_pins axi_dma_b1_2/m_axi_sg_aclk] [get_bd_pins axi_dma_b2_2/s_axi_lite_aclk] \
  [get_bd_pins axi_dma_b2_2/m_axi_sg_aclk] [get_bd_pins axi_dma_b2_2/m_axi_mm2s_aclk] \
  [get_bd_pins axi_dma_b1_1/m_axi_mm2s_aclk] [get_bd_pins axis_data_fifo_b1_2/s_axis_aclk] \
  [get_bd_pins axis_data_fifo_b2_2/s_axis_aclk] [get_bd_pins axi_dma_b1_2/m_axi_mm2s_aclk] [get_bd_pins smartconnect_1/aclk] \
  [get_bd_pins smartconnect_2/aclk] [get_bd_pins smartconnect_3/aclk] [get_bd_pins smartconnect_4/aclk]
connect_bd_net [get_bd_pins processing_system7_0/FCLK_CLK1] \
  [get_bd_pins proc_sys_reset_zmod_control/slowest_sync_clk] [get_bd_pins smartconnect_0/aclk] \
  [get_bd_pins processing_system7_0/M_AXI_GP1_ACLK] [get_bd_pins axi_fifo_b1_spi/s_axi_aclk] \
  [get_bd_pins axi_gpio_b1_ch1_coeff/s_axi_aclk] [get_bd_pins axi_gpio_b1_ch2_coeff/s_axi_aclk] \
  [get_bd_pins axi_fifo_b2_spi/s_axi_aclk] [get_bd_pins axi_gpio_b2_ch1_coeff/s_axi_aclk] \
  [get_bd_pins axi_gpio_b2_ch2_coeff/s_axi_aclk] [get_bd_pins axi_gpio_dac_trigger/s_axi_aclk] \
  [get_bd_pins axi_gpio_clock_select/s_axi_aclk] [get_bd_pins axi_gpio_dma_trigger/s_axi_aclk]
connect_bd_net [get_bd_pins processing_system7_0/FCLK_RESET0_N] \
  [get_bd_pins rst_clk_wiz_ps_125M/ext_reset_in] [get_bd_pins proc_sys_reset_zmod_control/ext_reset_in] \
  [get_bd_pins proc_sys_reset_zmod_dac/ext_reset_in]
connect_bd_net [get_bd_pins rst_clk_wiz_ps_125M/peripheral_aresetn] \
  [get_bd_pins axi_smc/aresetn] [get_bd_pins axi_dma_b2_2/axi_resetn] [get_bd_pins axi_dma_b2_1/axi_resetn] \
  [get_bd_pins axi_dma_b1_2/axi_resetn] [get_bd_pins axi_dma_b1_1/axi_resetn] [get_bd_pins smartconnect_1/aresetn] \
  [get_bd_pins smartconnect_2/aresetn] [get_bd_pins smartconnect_3/aresetn] [get_bd_pins smartconnect_4/aresetn]
connect_bd_net -net trig_in_1_0_1 [get_bd_ports dac_trigger_in] [get_bd_pins dac_master_controller_0/dac_run_remote_in]
connect_bd_net [get_bd_pins util_vector_logic_0/Res] [get_bd_ports led_src_r]
connect_bd_net [get_bd_pins util_vector_logic_1/Res] [get_bd_ports led_locked_r]
connect_bd_net -net xlslice_0_Dout [get_bd_pins axi_gpio_dac_trigger/gpio_io_o] [get_bd_pins dac_master_controller_0/dac_run_local_in]

# ---- address map ----
assign_bd_address -offset 0x00000000 -range 1G -target_address_space [get_bd_addr_spaces axi_dma_b1_1/Data_MM2S] [get_bd_addr_segs processing_system7_0/S_AXI_HP0/HP0_DDR_LOWOCM]
assign_bd_address -offset 0x00000000 -range 1G -target_address_space [get_bd_addr_spaces axi_dma_b1_1/Data_S2MM] [get_bd_addr_segs processing_system7_0/S_AXI_HP0/HP0_DDR_LOWOCM]
assign_bd_address -offset 0x00000000 -range 1G -target_address_space [get_bd_addr_spaces axi_dma_b1_1/Data_SG] [get_bd_addr_segs processing_system7_0/S_AXI_HP0/HP0_DDR_LOWOCM]
assign_bd_address -offset 0x00000000 -range 1G -target_address_space [get_bd_addr_spaces axi_dma_b1_2/Data_MM2S] [get_bd_addr_segs processing_system7_0/S_AXI_HP1/HP1_DDR_LOWOCM]
assign_bd_address -offset 0x00000000 -range 1G -target_address_space [get_bd_addr_spaces axi_dma_b1_2/Data_SG] [get_bd_addr_segs processing_system7_0/S_AXI_HP1/HP1_DDR_LOWOCM]
assign_bd_address -offset 0x00000000 -range 1G -target_address_space [get_bd_addr_spaces axi_dma_b2_1/Data_MM2S] [get_bd_addr_segs processing_system7_0/S_AXI_HP2/HP2_DDR_LOWOCM]
assign_bd_address -offset 0x00000000 -range 1G -target_address_space [get_bd_addr_spaces axi_dma_b2_1/Data_SG] [get_bd_addr_segs processing_system7_0/S_AXI_HP2/HP2_DDR_LOWOCM]
assign_bd_address -offset 0x00000000 -range 1G -target_address_space [get_bd_addr_spaces axi_dma_b2_2/Data_MM2S] [get_bd_addr_segs processing_system7_0/S_AXI_HP3/HP3_DDR_LOWOCM]
assign_bd_address -offset 0x00000000 -range 1G -target_address_space [get_bd_addr_spaces axi_dma_b2_2/Data_SG] [get_bd_addr_segs processing_system7_0/S_AXI_HP3/HP3_DDR_LOWOCM]
assign_bd_address -offset 0x40000000 -range 64K -target_address_space [get_bd_addr_spaces processing_system7_0/Data] [get_bd_addr_segs axi_dma_b1_1/S_AXI_LITE/Reg]
assign_bd_address -offset 0x40010000 -range 64K -target_address_space [get_bd_addr_spaces processing_system7_0/Data] [get_bd_addr_segs axi_dma_b1_2/S_AXI_LITE/Reg]
assign_bd_address -offset 0x40020000 -range 64K -target_address_space [get_bd_addr_spaces processing_system7_0/Data] [get_bd_addr_segs axi_dma_b2_1/S_AXI_LITE/Reg]
assign_bd_address -offset 0x40030000 -range 64K -target_address_space [get_bd_addr_spaces processing_system7_0/Data] [get_bd_addr_segs axi_dma_b2_2/S_AXI_LITE/Reg]
assign_bd_address -offset 0x81200000 -range 64K -target_address_space [get_bd_addr_spaces processing_system7_0/Data] [get_bd_addr_segs axi_gpio_b1_ch1_coeff/S_AXI/Reg]
assign_bd_address -offset 0x81210000 -range 64K -target_address_space [get_bd_addr_spaces processing_system7_0/Data] [get_bd_addr_segs axi_gpio_b1_ch2_coeff/S_AXI/Reg]
assign_bd_address -offset 0x81220000 -range 64K -target_address_space [get_bd_addr_spaces processing_system7_0/Data] [get_bd_addr_segs axi_gpio_b2_ch1_coeff/S_AXI/Reg]
assign_bd_address -offset 0x81230000 -range 64K -target_address_space [get_bd_addr_spaces processing_system7_0/Data] [get_bd_addr_segs axi_gpio_b2_ch2_coeff/S_AXI/Reg]
assign_bd_address -offset 0x81240000 -range 64K -target_address_space [get_bd_addr_spaces processing_system7_0/Data] [get_bd_addr_segs axi_gpio_clock_select/S_AXI/Reg]
assign_bd_address -offset 0x81250000 -range 64K -target_address_space [get_bd_addr_spaces processing_system7_0/Data] [get_bd_addr_segs axi_gpio_dac_trigger/S_AXI/Reg]
assign_bd_address -offset 0x81270000 -range 64K -target_address_space [get_bd_addr_spaces processing_system7_0/Data] [get_bd_addr_segs axi_gpio_dma_trigger/S_AXI/Reg]
assign_bd_address -offset 0x83C00000 -range 64K -target_address_space [get_bd_addr_spaces processing_system7_0/Data] [get_bd_addr_segs axi_fifo_b1_spi/S_AXI/Mem0]
assign_bd_address -offset 0x83C10000 -range 64K -target_address_space [get_bd_addr_spaces processing_system7_0/Data] [get_bd_addr_segs axi_fifo_b2_spi/S_AXI/Mem0]

validate_bd_design
save_bd_design
